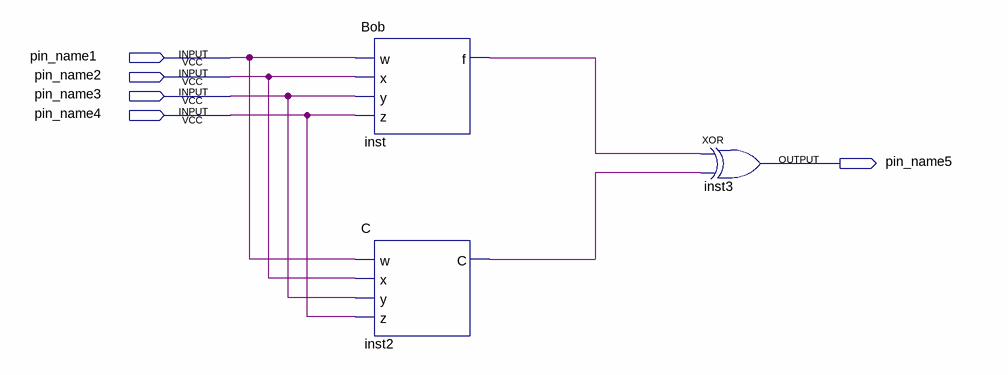
[diagram p0: schematic sheet]
// Quartus schematic Final.bdf as structural Verilog: 3 symbols, 5 pins
module Final (
  input  pin_name1,
  input  pin_name2,
  input  pin_name3,
  input  pin_name4,
  output pin_name5
);

  wire inst2_c, inst_f;

  Bob inst (.w(pin_name1), .x(pin_name2), .y(pin_name3), .z(pin_name4), .f(inst_f));
  C inst2 (.w(pin_name1), .x(pin_name2), .y(pin_name3), .z(pin_name4), .C(inst2_c));
  xor inst3 (pin_name5, inst_f, inst2_c);
endmodule
